# EAGLE schematic BATT_CONN (EAGLE 9.6.2)
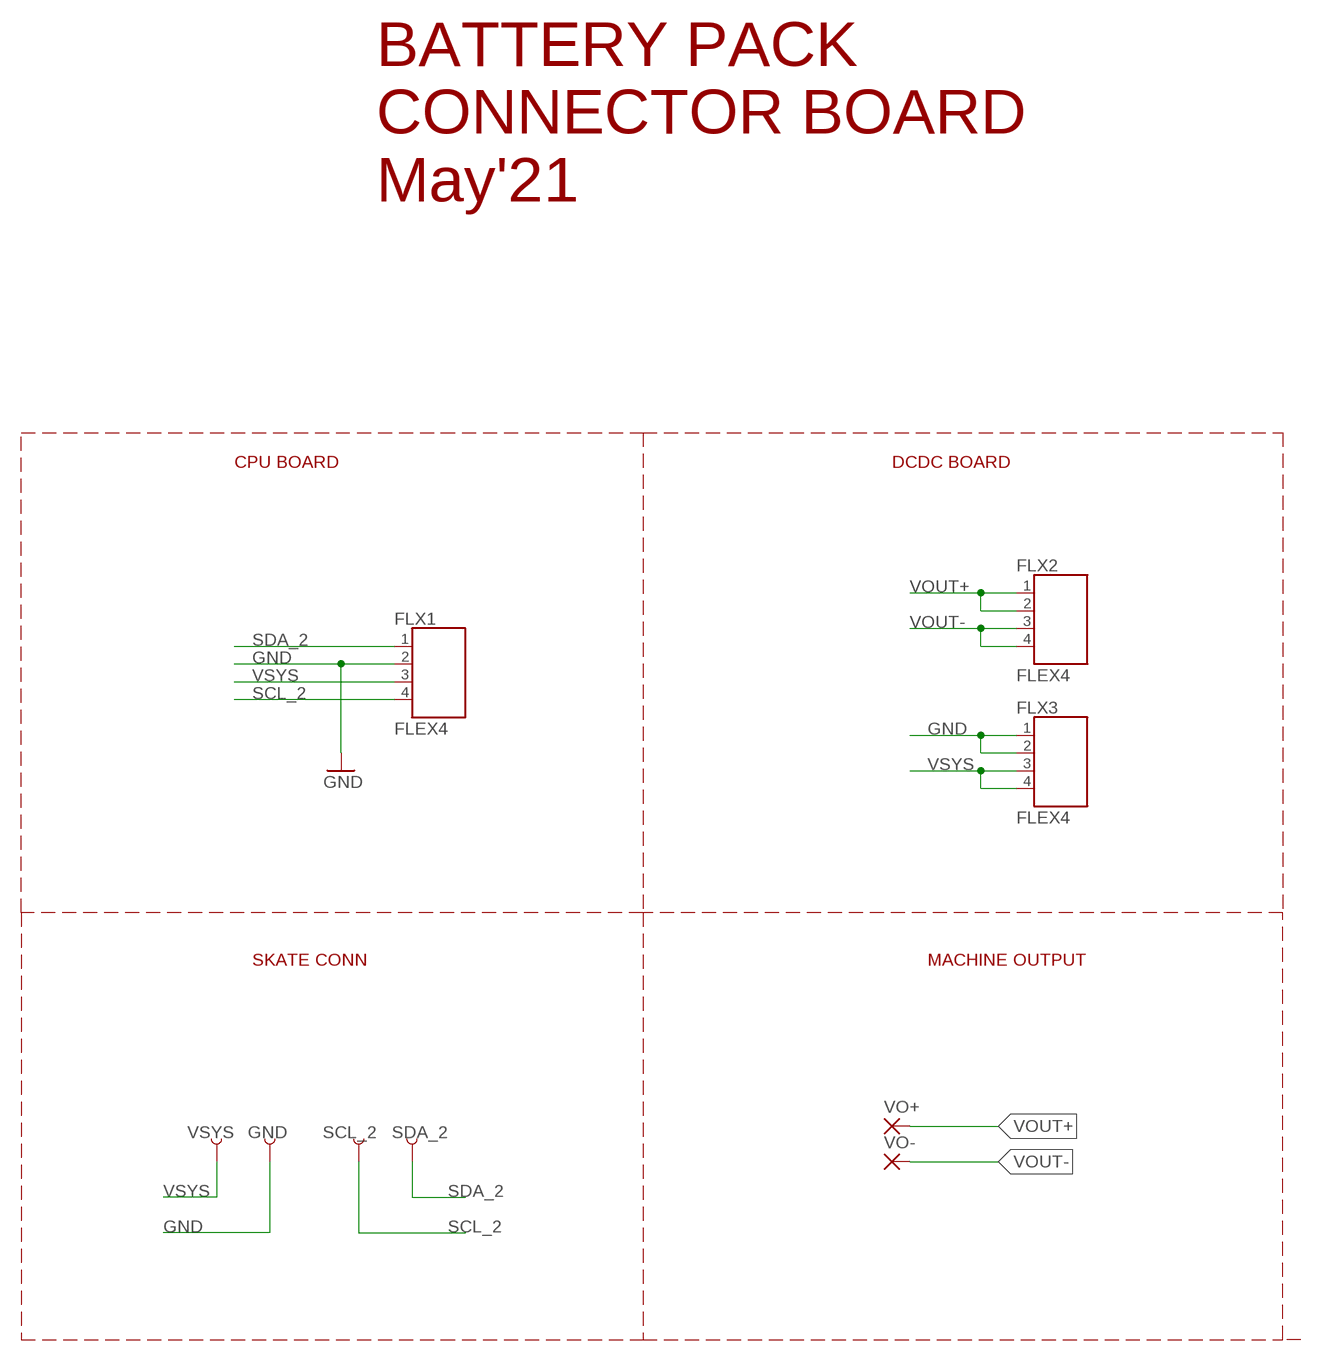
[diagram p0: schematic, sheet 1]

## Parts
FLX1  FLEX4  [FLEX4]
FLX2  FLEX4  [FLEX4]
FLX3  FLEX4  [FLEX4]
GND  TEST-POINT3  [PAD.03X.03]
SCL_2  TEST-POINT3  [PAD.03X.03]
SDA_2  TEST-POINT3  [PAD.03X.03]
VO+  SMD5  [SMD2,54-5,08]
VO-  SMD5  [SMD2,54-5,08]
VSYS  TEST-POINT3  [PAD.03X.03]

## Nets
GND: FLX1.2 FLX3.1 FLX3.2 GND.P$1
SCL_2: FLX1.4 SCL_2.P$1
SDA_2: FLX1.1 SDA_2.P$1
VOUT+: FLX2.1 FLX2.2 VO+.1(P)
VOUT-: FLX2.3 FLX2.4 VO-.1(P)
VSYS: FLX1.3 FLX3.3 FLX3.4 VSYS.P$1

## Notes on the sheet
- BATTERY PACK
  CONNECTOR BOARD
  May'21
- CPU BOARD | DCDC BOARD
- SKATE CONN | MACHINE OUTPUT

## Library data of the parts
FLX1-FLX3 = Flex4:FLEX4
GND SCL_2 SDA_2 VSYS = SparkFun-Connectors:TEST-POINT: SparkFun Test Points Bare copper test points for troubleshooting or In-Circuit-Testing. These are used by our Production team for verifying production board runs using pogo-pins on test beds. SparkFun Products: SparkFun LSM9DS1 Breakout <https://www.sparkfun.com/products/13284> SparkFun PSOC <https://www.sparkfun.com/products/13714> SparkFun Load Cell Amplifier <https://www.sparkfun.com/products/13879>
VO+ VO- = wirepad:SMD5: SMD PAD

## Net classes
1 power: width 0.178 mm
2 gnd: width 0.305 mm, drill 0.483 mm, clearance 0.203 mm